# EAGLE schematic module_core_1 (EAGLE 5.10)
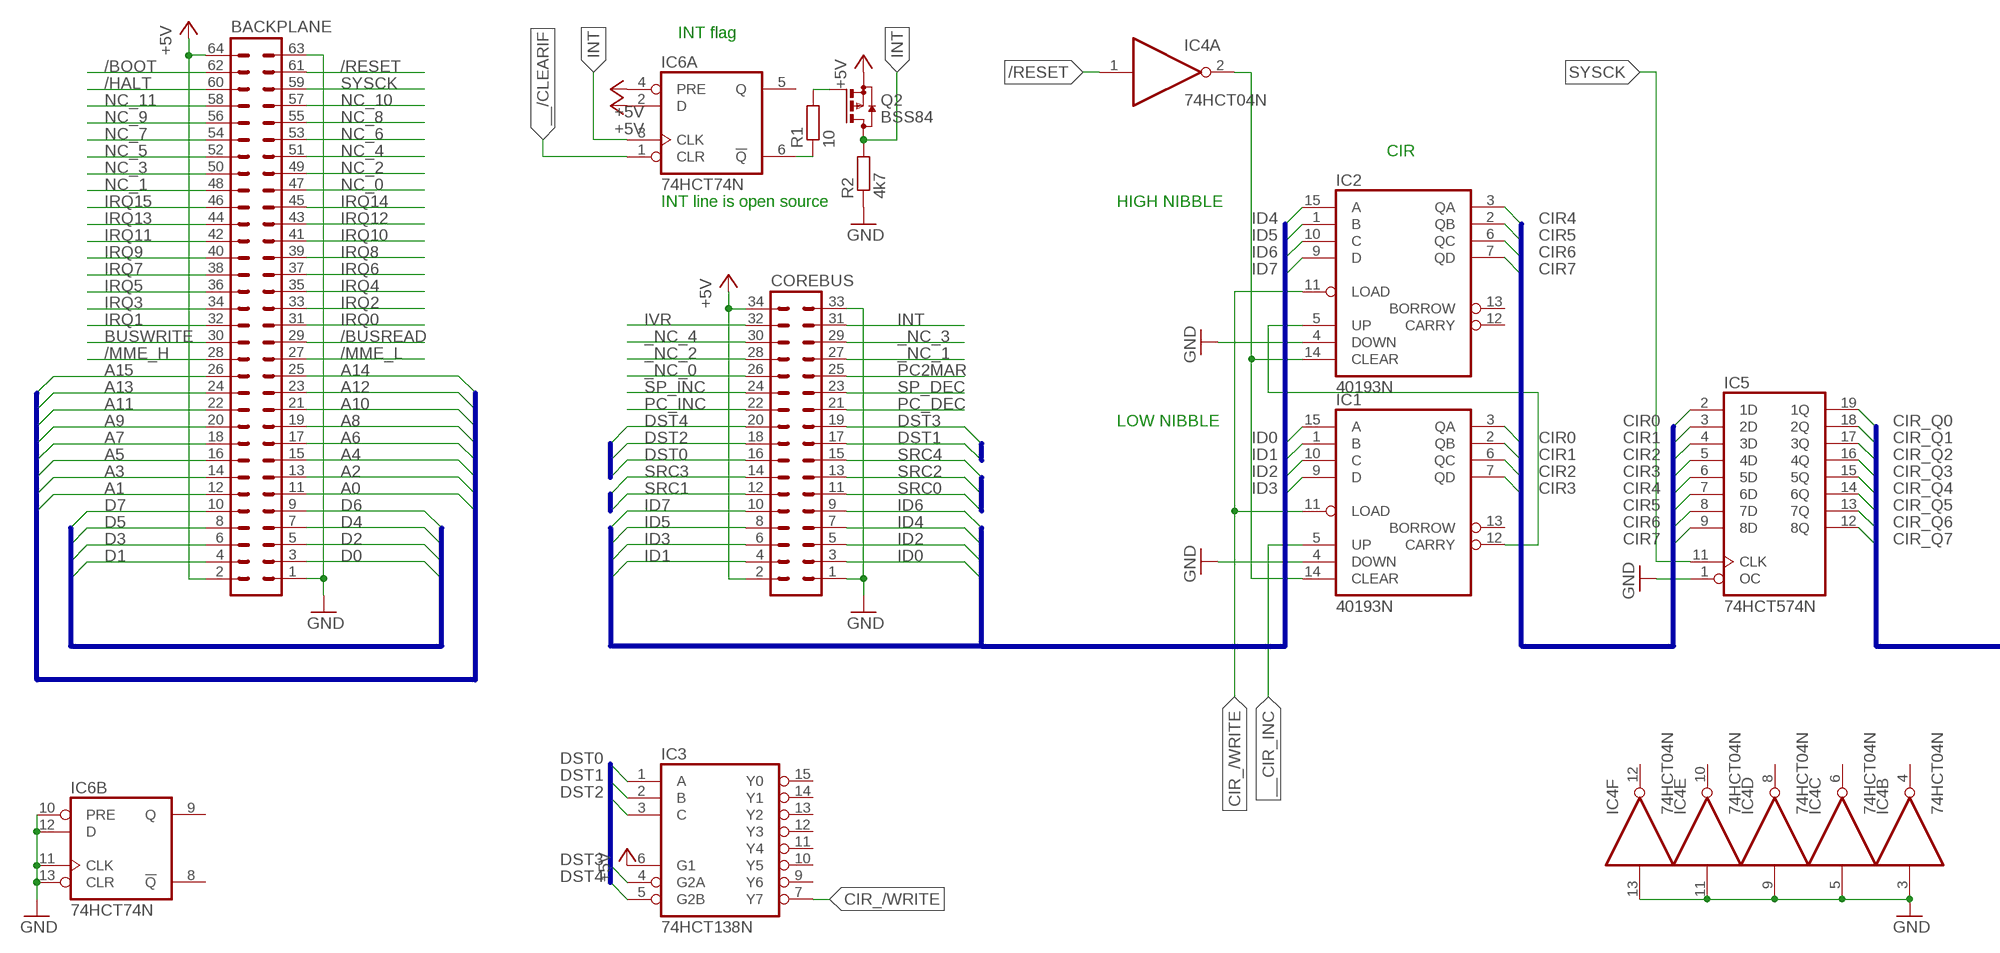
[diagram p0: schematic, sheet 1, part 1 of 2]
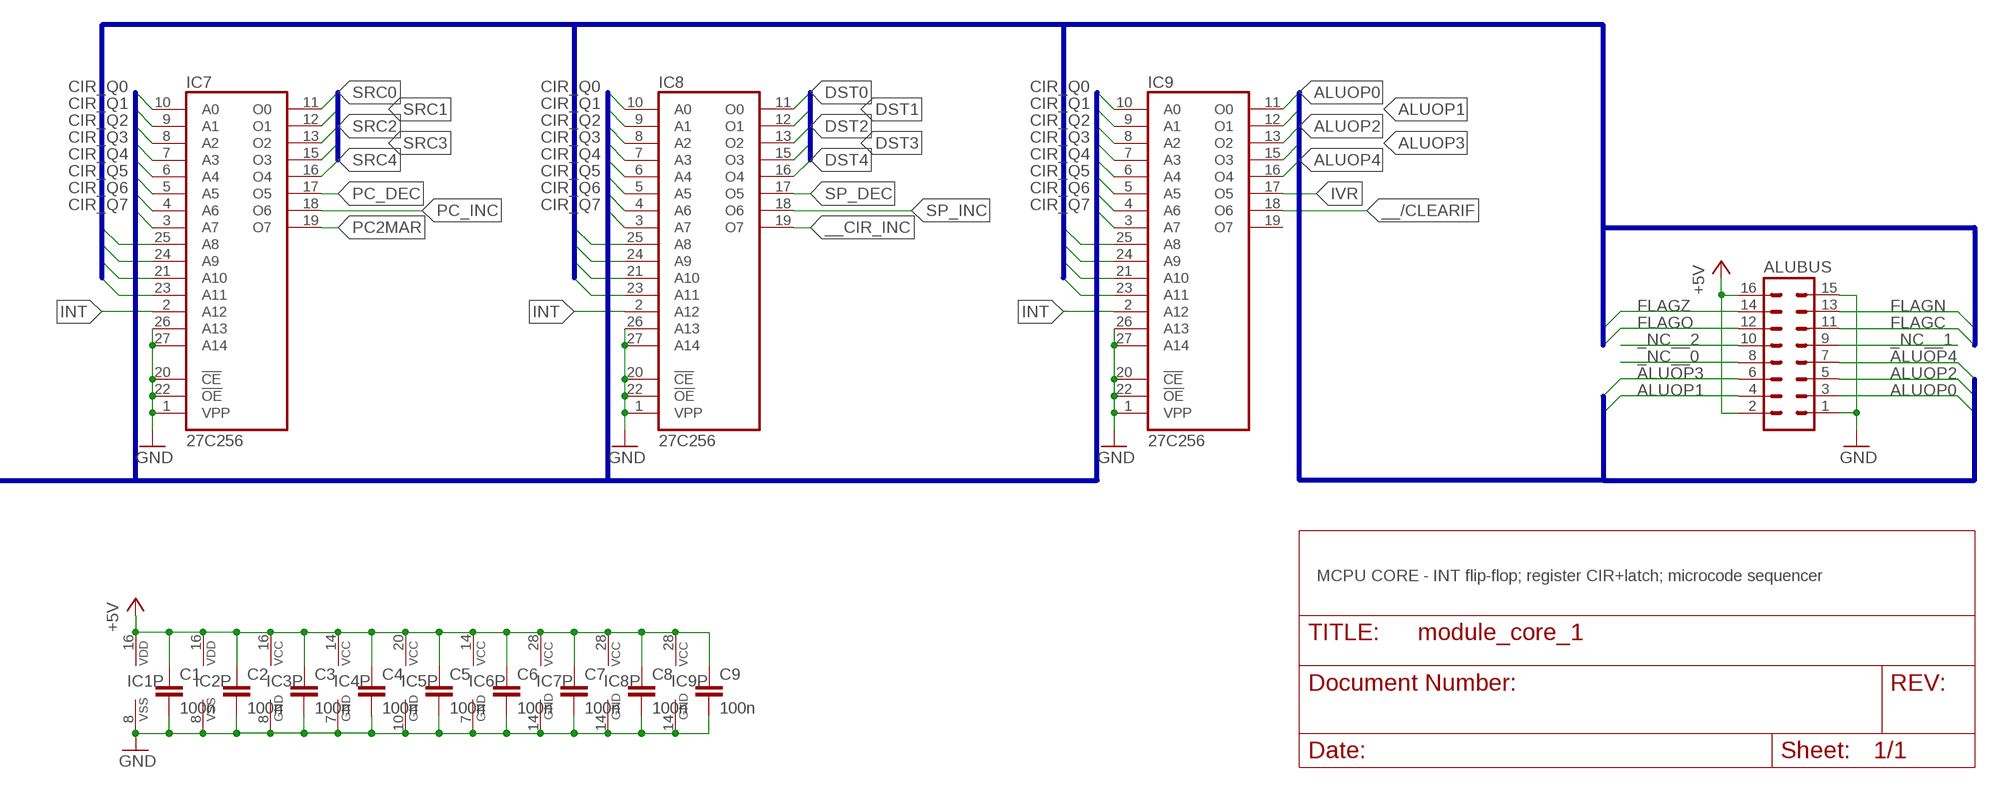
[diagram p1: schematic, sheet 1, part 2 of 2]

## Parts
ALUBUS  ML16L  [ML16L]
BACKPLANE  ML64L  [ML64L]
C1  100n  C-EUC1206  [C1206]
C2  100n  C-EUC1206  [C1206]
C3  100n  C-EUC1206  [C1206]
C4  100n  C-EUC1206  [C1206]
C5  100n  C-EUC1206  [C1206]
C6  100n  C-EUC1206  [C1206]
C7  100n  C-EUC1206  [C1206]
C8  100n  C-EUC1206  [C1206]
C9  100n  C-EUC1206  [C1206]
COREBUS  ML34L  [ML34L]
IC1  40193N  [DIL16]
IC2  40193N  [DIL16]
IC3  74HCT138N  [DIL16]
IC4  74HCT04N  [DIL14]
IC5  74HCT574N  [DIL20]
IC6  74HCT74N  [DIL14]
IC7  27C256  27256  [DIL28]
IC8  27C256  27256  [DIL28]
IC9  27C256  27256  [DIL28]
Q2  BSS84  [SOT23]
R1  10  R-EU_R1206  [R1206]
R2  4k7  R-EU_R1206  [R1206]

## Nets
+5V: ALUBUS.2 ALUBUS.16 BACKPLANE.2 BACKPLANE.64 C1.1 C2.1 C3.1 C4.1 C5.1 C6.1 C7.1 C8.1 C9.1 COREBUS.2 COREBUS.34 IC1.16(VDD) IC2.16(VDD) IC3.6(G1) IC3.16(VCC) IC4.14(P:VCC) IC5.20(VCC) IC6.2(A:D) IC6.4(A:PRE) IC6.14(P:VCC) IC7.28(VCC) IC8.28(VCC) IC9.28(VCC) Q2.2(S)
/BOOT: BACKPLANE.62
/BUSREAD: BACKPLANE.29
/HALT: BACKPLANE.60
/MME_H: BACKPLANE.28
/MME_L: BACKPLANE.27
/RESET: BACKPLANE.61 IC4.1(A:I)
__/CLEARIF: IC6.1(A:CLR) IC9.18(O6)
__CIR_INC: IC1.5(UP) IC8.19(O7)
_NC_0: COREBUS.26
_NC_1: COREBUS.27
_NC_2: COREBUS.28
_NC_3: COREBUS.29
_NC_4: COREBUS.30
_NC__0: ALUBUS.8
_NC__1: ALUBUS.9
_NC__2: ALUBUS.10
A0: BACKPLANE.11
A1: BACKPLANE.12
A2: BACKPLANE.13
A3: BACKPLANE.14
A4: BACKPLANE.15
A5: BACKPLANE.16
A6: BACKPLANE.17
A7: BACKPLANE.18
A8: BACKPLANE.19
A9: BACKPLANE.20
A10: BACKPLANE.21
A11: BACKPLANE.22
A12: BACKPLANE.23
A13: BACKPLANE.24
A14: BACKPLANE.25
A15: BACKPLANE.26
ALUOP0: ALUBUS.3 IC9.11(O0)
ALUOP1: ALUBUS.4 IC9.12(O1)
ALUOP2: ALUBUS.5 IC9.13(O2)
ALUOP3: ALUBUS.6 IC9.15(O3)
ALUOP4: ALUBUS.7 IC9.16(O4)
BUSWRITE: BACKPLANE.30
CIR0: IC1.3(QA) IC5.2(1D)
CIR1: IC1.2(QB) IC5.3(2D)
CIR2: IC1.6(QC) IC5.4(3D)
CIR3: IC1.7(QD) IC5.5(4D)
CIR4: IC2.3(QA) IC5.6(5D)
CIR5: IC2.2(QB) IC5.7(6D)
CIR6: IC2.6(QC) IC5.8(7D)
CIR7: IC2.7(QD) IC5.9(8D)
CIR_/WRITE: IC1.11(LOAD) IC2.11(LOAD) IC3.7(Y7)
CIR_Q0: IC5.19(1Q) IC7.10(A0) IC8.10(A0) IC9.10(A0)
CIR_Q1: IC5.18(2Q) IC7.9(A1) IC8.9(A1) IC9.9(A1)
CIR_Q2: IC5.17(3Q) IC7.8(A2) IC8.8(A2) IC9.8(A2)
CIR_Q3: IC5.16(4Q) IC7.7(A3) IC8.7(A3) IC9.7(A3)
CIR_Q4: IC5.15(5Q) IC7.6(A4) IC8.6(A4) IC9.6(A4)
CIR_Q5: IC5.14(6Q) IC7.5(A5) IC8.5(A5) IC9.5(A5)
CIR_Q6: IC5.13(7Q) IC7.4(A6) IC8.4(A6) IC9.4(A6)
CIR_Q7: IC5.12(8Q) IC7.3(A7) IC8.3(A7) IC9.3(A7)
D0: BACKPLANE.3
D1: BACKPLANE.4
D2: BACKPLANE.5
D3: BACKPLANE.6
D4: BACKPLANE.7
D5: BACKPLANE.8
D6: BACKPLANE.9
D7: BACKPLANE.10
DST0: COREBUS.16 IC3.1(A) IC8.11(O0)
DST1: COREBUS.17 IC3.2(B) IC8.12(O1)
DST2: COREBUS.18 IC3.3(C) IC8.13(O2)
DST3: COREBUS.19 IC3.4(G2A) IC8.15(O3)
DST4: COREBUS.20 IC3.5(G2B) IC8.16(O4)
FLAGC: ALUBUS.11 IC7.25(A8) IC8.25(A8) IC9.25(A8)
FLAGN: ALUBUS.13 IC7.21(A10) IC8.21(A10) IC9.21(A10)
FLAGO: ALUBUS.12 IC7.24(A9) IC8.24(A9) IC9.24(A9)
FLAGZ: ALUBUS.14 IC7.23(A11) IC8.23(A11) IC9.23(A11)
GND: ALUBUS.1 ALUBUS.15 BACKPLANE.1 BACKPLANE.63 C1.2 C2.2 C3.2 C4.2 C5.2 C6.2 C7.2 C8.2 C9.2 COREBUS.1 COREBUS.33 IC1.4(DOWN) IC1.8(VSS) IC2.4(DOWN) IC2.8(VSS) IC3.8(GND) IC4.3(B:I) IC4.5(C:I) IC4.7(P:GND) IC4.9(D:I) IC4.11(E:I) IC4.13(F:I) IC5.1(OC) IC5.10(GND) IC6.7(P:GND) IC6.10(B:PRE) IC6.11(B:CLK) IC6.12(B:D) IC6.13(B:CLR) IC7.1(VPP) IC7.14(GND) IC7.20(!CE) IC7.22(!OE) IC7.26(A13) IC7.27(A14) IC8.1(VPP) IC8.14(GND) IC8.20(!CE) IC8.22(!OE) IC8.26(A13) IC8.27(A14) IC9.1(VPP) IC9.14(GND) IC9.20(!CE) IC9.22(!OE) IC9.26(A13) IC9.27(A14) R2.1
ID0: COREBUS.3 IC1.15(A)
ID1: COREBUS.4 IC1.1(B)
ID2: COREBUS.5 IC1.10(C)
ID3: COREBUS.6 IC1.9(D)
ID4: COREBUS.7 IC2.15(A)
ID5: COREBUS.8 IC2.1(B)
ID6: COREBUS.9 IC2.10(C)
ID7: COREBUS.10 IC2.9(D)
INT: COREBUS.31 IC6.3(A:CLK) IC7.2(A12) IC8.2(A12) IC9.2(A12) Q2.3(D) R2.2
IRQ0: BACKPLANE.31
IRQ1: BACKPLANE.32
IRQ2: BACKPLANE.33
IRQ3: BACKPLANE.34
IRQ4: BACKPLANE.35
IRQ5: BACKPLANE.36
IRQ6: BACKPLANE.37
IRQ7: BACKPLANE.38
IRQ8: BACKPLANE.39
IRQ9: BACKPLANE.40
IRQ10: BACKPLANE.41
IRQ11: BACKPLANE.42
IRQ12: BACKPLANE.43
IRQ13: BACKPLANE.44
IRQ14: BACKPLANE.45
IRQ15: BACKPLANE.46
IVR: COREBUS.32 IC9.17(O5)
N$1: IC6.6(A:!Q) R1.1
N$2: IC1.12(CARRY) IC2.5(UP)
N$3: Q2.1(G) R1.2
N$16: IC1.14(CLEAR) IC2.14(CLEAR) IC4.2(A:O)
NC_0: BACKPLANE.47
NC_1: BACKPLANE.48
NC_2: BACKPLANE.49
NC_3: BACKPLANE.50
NC_4: BACKPLANE.51
NC_5: BACKPLANE.52
NC_6: BACKPLANE.53
NC_7: BACKPLANE.54
NC_8: BACKPLANE.55
NC_9: BACKPLANE.56
NC_10: BACKPLANE.57
NC_11: BACKPLANE.58
PC2MAR: COREBUS.25 IC7.19(O7)
PC_DEC: COREBUS.21 IC7.17(O5)
PC_INC: COREBUS.22 IC7.18(O6)
SP_DEC: COREBUS.23 IC8.17(O5)
SP_INC: COREBUS.24 IC8.18(O6)
SRC0: COREBUS.11 IC7.11(O0)
SRC1: COREBUS.12 IC7.12(O1)
SRC2: COREBUS.13 IC7.13(O2)
SRC3: COREBUS.14 IC7.15(O3)
SRC4: COREBUS.15 IC7.16(O4)
SYSCK: BACKPLANE.59 IC5.11(CLK)
Unconnected: IC1.13(BORROW) IC2.12(CARRY) IC2.13(BORROW) IC3.9(Y6) IC3.10(Y5) IC3.11(Y4) IC3.12(Y3) IC3.13(Y2) IC3.14(Y1) IC3.15(Y0) IC4.4(B:O) IC4.6(C:O) IC4.8(D:O) IC4.10(E:O) IC4.12(F:O) IC6.5(A:Q) IC6.8(B:!Q) IC6.9(B:Q) IC9.19(O7)

## Buses
D[0..7]
A[0..15]
ID[0..7]
DST[0..4]
SRC[0..4]
CIR[0..7]
CIR_Q[0..7]
LFLAGS:FLAGC,FLAGO,FLAGN,FLAGZ
ALUOP[0..4]

## Notes on the sheet
- INT flag
- CIR
- INT line is open source | HIGH NIBBLE
- LOW NIBBLE
- MCPU CORE - INT flip-flop; register CIR+latch; microcode sequencer

## Library data of the parts
ALUBUS = mcpu:ML16L: HARTING
BACKPLANE = mcpu:ML64L: HARTING
C1-C9 = rcl:C-EU: CAPACITOR, European symbol
COREBUS = mcpu:ML34L: HARTING
IC1 IC2 = 40xx:40193: Binary up down COUNTER
IC3 = 74xx-eu:74*138: 3-line to 8-line DECODER/DEMULTIPLEXER
IC4 = 74xx-eu:74*04: Hex INVERTER
IC5 = 74xx-eu:74*574: 8-bit D type FLIP FLOP bus driver
IC6 = 74xx-eu:74*74: Dual D type positive edge triggered FLIP FLOP, preset and clear
IC7-IC9 = memory:27256: MEMORY
Q2 = transistor-small-signal:BSS84: P-CHANNEL MOS FET
R1 R2 = rcl:R-EU_: RESISTOR, European symbol

## Net classes
0 Signal: width 0.305 mm, drill 0.508 mm, clearance 0.203 mm
1 LoVolt42: width 0.61 mm, drill 0.508 mm, clearance 0.813 mm to class 0, clearance 0.305 mm
2 MedVolt100: width 0.61 mm, drill 0.508 mm, clearance 1.626 mm to class 0, clearance 1.626 mm to class 1, clearance 0.813 mm
3 LineVolt350: width 0.813 mm, drill 0.508 mm, clearance 12.7 mm to class 0, clearance 12.7 mm to class 1, clearance 12.7 mm to class 2, clearance 2.54 mm